# EAGLE design FAB_FTDI (EAGLE 7.3.0)
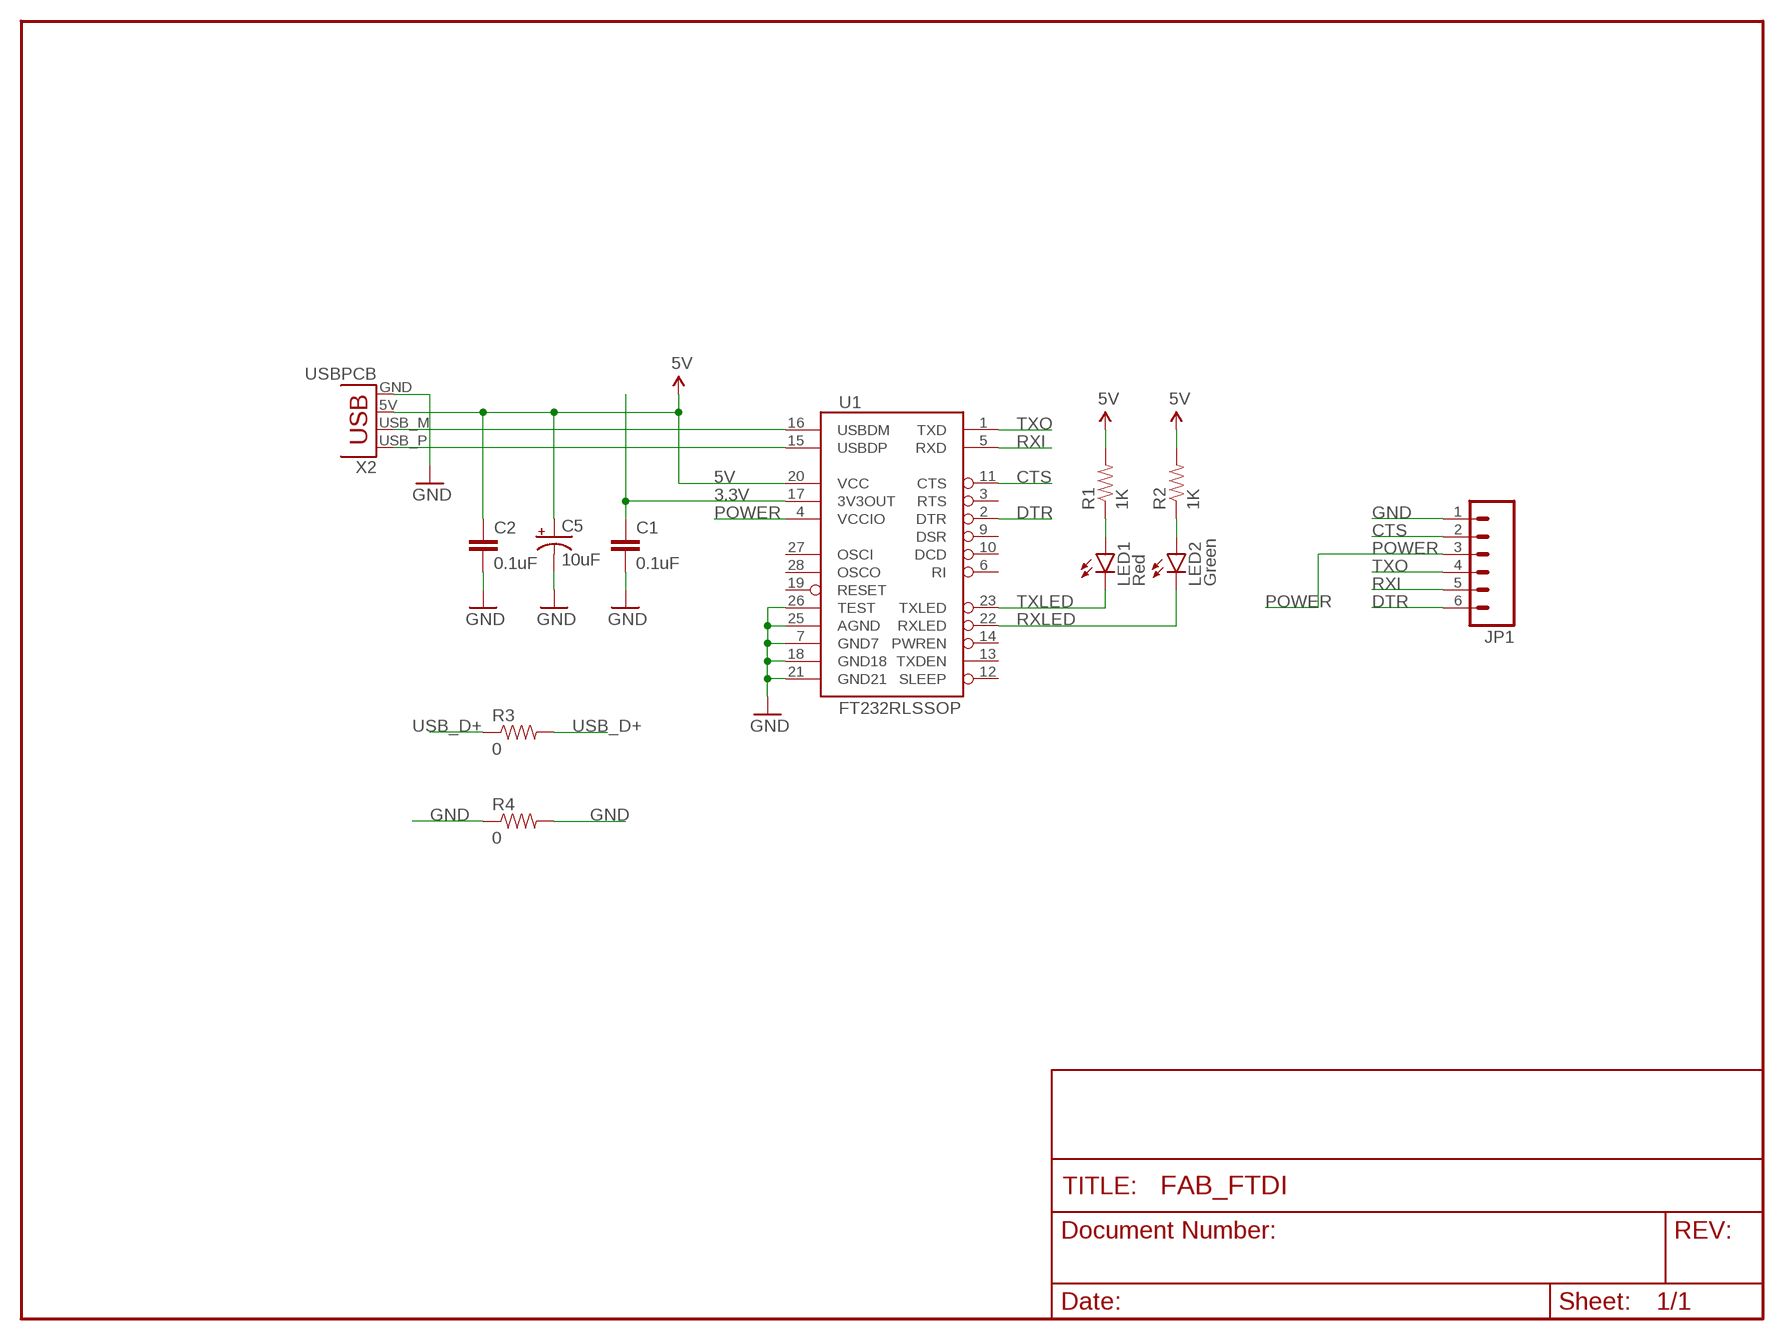
[diagram p0: schematic, sheet 1]

## Parts
C1  0.1uF  CAP1206  [1206]
C2  0.1uF  CAP1206  [1206]
C5  10uF  CAP_POL1206  [EIA3216]
JP1  M06SMD-FEMALE-V2  [1X06-SMD-FEMALE-V2]
LED1  Red  LED1206  [LED-1206]
LED2  Green  LED1206  [LED-1206]
R1  1K  RESISTOR1206  [1206]
R2  1K  RESISTOR1206  [1206]
R3  0  RESISTOR1206  [1206]
R4  0  RESISTOR1206  [1206]
U1  FT232RLSSOP  [SSOP28DB]
X2  USBPCB  [USB-A-PCB]

## Nets
3.3V [power]: C1.1 U1.17(3V3OUT)
5V: C2.1 C5.A(+) R1.2 R2.2 U1.20(VCC) X2.5V(VBUS)
CTS: JP1.2 U1.11(CTS)
DTR: JP1.6 U1.2(DTR)
GND [power]: C1.2 C2.2 C5.C(-) JP1.1 R4.1 R4.2 U1.7(GND7) U1.18(GND18) U1.21(GND21) U1.25(AGND) U1.26(TEST) X2.GND
N$1: LED1.A R1.1
N$2: LED2.A R2.1
POWER: JP1.3 U1.4(VCCIO)
RXI: JP1.5 U1.5(RXD)
RXLED: LED2.C U1.22(RXLED)
TXLED: LED1.C U1.23(TXLED)
TXO: JP1.4 U1.1(TXD)
USB_D+: R3.1 R3.2 U1.15(USBDP) X2.USB_P(D+)
USB_D-: U1.16(USBDM) X2.USB_M(D-)
Unconnected: U1.3(RTS) U1.6(RI) U1.9(DSR) U1.10(DCD) U1.12(SLEEP) U1.13(TXDEN) U1.14(PWREN) U1.19(RESET) U1.27(OSCI) U1.28(OSCO)

## Library data of the parts
C1 C2 = SparkFun-Capacitors:CAP: Capacitor Standard 0603 ceramic capacitor, and 0.1" leaded capacitor.
C5 = SparkFun:CAP_POL: Capacitor Polarized These are standard SMD and PTH capacitors. Normally 10uF, 47uF, and 100uF in electrolytic and tantalum varieties. Always verify the external diameter of the through hole cap, it varies with capacity, voltage, and manufacturer. The EIA devices should be standard.
JP1 = SparkFun:M06: Header 6 Standard 6-pin 0.1" header. Use with straight break away headers (SKU : PRT-00116), right angle break away headers (PRT-00553), swiss pins (PRT-00743), machine pins (PRT-00117), and female headers (PRT-00115). Molex polarized connector foot print use with SKU : PRT-08094 with associated crimp pins and housings. NOTES ON THE VARIANTS LOCK and LOCK_LONGPADS... This footprint was designed to help hold the alignment of a through-hole component (i.e. 6-pin header) while soldering it into place. You may notice that each hole has been shifted either up or down by 0.005 of an inch from it's more standard position (which is a perfectly straight line). This slight alteration caused the pins (the squares in the middle) to touch the edges of the holes. Because they are alternating, it causes a "brace" to hold the component in place. 0.005 has proven to be the perfect amount of "off-center" position when using our standard breakaway headers. Although looks a little odd when you look at the bare footprint, once you have a header in there, the alteration is very hard to notice. Also, if you push a header all the way into place, it is covered up entirely on the bottom side. This idea of altering the position of holes to aid alignment will be further integrated into the Sparkfun Library for other footprints. It can help hold any component with 3 or more connection pins.
LED1 LED2 = SparkFun-LED:LED: LEDs Standard schematic elements and footprints for 5mm, 3mm, 1206, and 0603 sized LEDs. 5mm - Spark Fun Electronics SKU : COM-00529 (and others)
R1-R4 = SparkFun-Resistors:RESISTOR: Resistor Basic schematic elements and footprints for 0603, 1206, and PTH resistors.
U1 = SparkFun:FT232RL: USB UART FT232RL 4th Generation USB UART (USB <-> Serial) Controller. Spark Fun Electronics SKU : COM-00650
X2 = SparkFun-Connectors:USB: USB Connectors USB-B-PTH is fully proven SKU : PRT-00139/CONN-08278 USB-miniB is fully proven SKU : PRT-00587 USB-A-PCB is untested. USB-A-H is throughly reviewed, but untested. Spark Fun Electronics SKU : PRT-00437 USB-B-SMT is throughly reviewed, but untested. Needs silkscreen touching up. USB-A-S has not been used/tested USB-MB-H has not been used/tested USB-MICROB has been used. CONN-09505

## Net classes
0 default: width 0.203 mm
1 power: width 0.254 mm

## Board
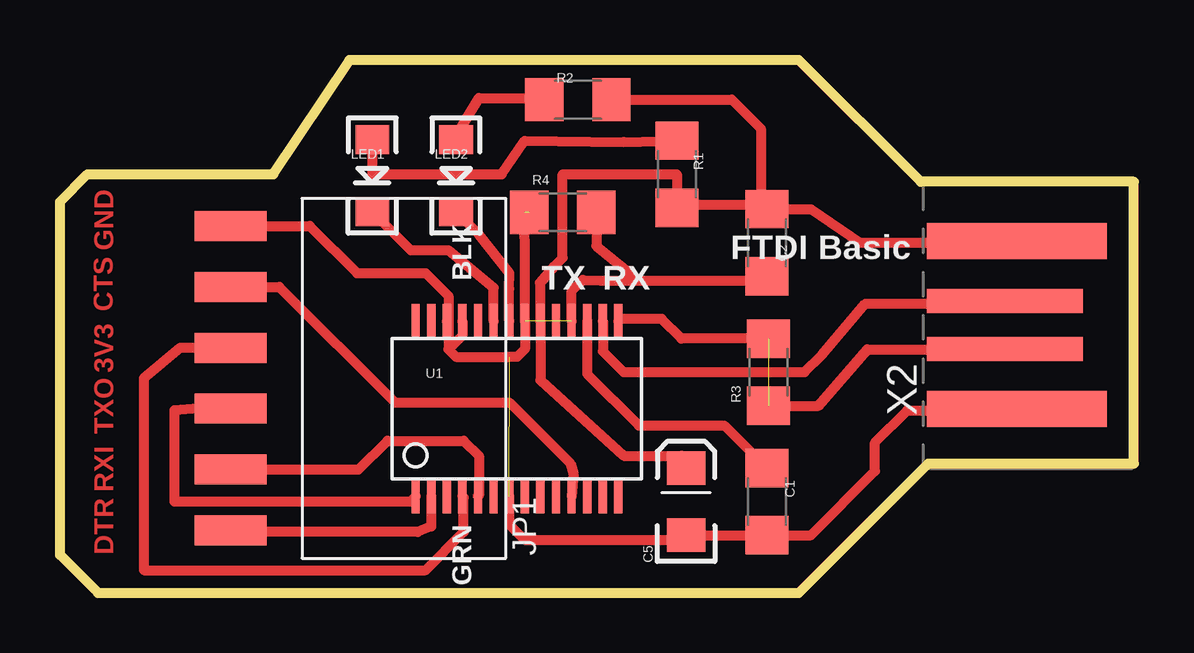
[diagram p1: board, top side]

Size 44.77 x 22.23 mm. Coordinates in mm from the lower left corner, seen from the top.
Outline: 1.59,0 30.8,0 36.2,5.4 44.77,5.4 44.77,17.14 35.88,17.14 30.8,22.23 12.06,22.23 8.89,17.46 1.15,17.46 0,16.32 0,1.59 1.59,0
Copper layers (1*16): Top 0.035mm / dielectric 1.5mm / Bottom 0.035mm
Design rules "SparkFun": minimum track width 8mil, minimum drill 20mil, track to track 8mil, track to pad 8mil, pad to pad 8mil, via to via 8mil, smd to smd 8mil, copper to edge 8mil, drill to drill 8mil, minimum pad ring 12mil, minimum via ring 10mil, stop-mask expansion 4mil, vias tented up to drill 20mil, thermal gap 10mil

### Footprints (pad centres in the part's own frame; a part is rotated, then mirrored left to right if it is on the bottom)
1206 = smd 1.6 x 1.8: 1 -1.4,0; 2 1.4,0
EIA3216 = smd 1.4 x 1.6: A 1.4,0; C -1.4,0
1X06-SMD-FEMALE-V2 = smd 1.25 x 3: 1 6.35,3.425; 2 3.81,3.425; 3 1.27,3.425; 4 -1.27,3.425; 5 -3.81,3.425; 6 -6.35,3.425
LED-1206 = smd 1.2 x 1.4: A -1.5,0; C 1.5,0
SSOP28DB = smd 0.348 x 1.397: 1 -4.225,-3.656; 2 -3.575,-3.656; 3 -2.925,-3.656; 4 -2.275,-3.656; 5 -1.625,-3.656; 6 -0.975,-3.656; 7 -0.325,-3.656; 8 0.325,-3.656; 9 0.975,-3.656; 10 1.625,-3.656; 11 2.275,-3.656; 12 2.925,-3.656; 13 3.575,-3.656; 14 4.225,-3.656; 15 4.225,3.656; 16 3.575,3.656; 17 2.925,3.656; 18 2.275,3.656; 19 1.625,3.656; 20 0.975,3.656; 21 0.325,3.656; 22 -0.325,3.656; 23 -0.975,3.656; 24 -1.625,3.656; 25 -2.275,3.656; 26 -2.925,3.656; 27 -3.575,3.656; 28 -4.225,3.656
USB-A-PCB = smd 7.5 x 1.5: 5V -0.2,-3.5; GND -0.2,3.5 | smd 6.5 x 1: USB_M 0.3,-1; USB_P 0.3,1

### Placement (x,y rotation side)
C1  29.46,3.81 270 top
C2  29.46,14.61 270 top
C5  26.1,3.81 90 top
JP1  10.54,8.95 90 top
LED1  13.02,17.4 270 top
LED2  16.51,17.4 270 top
R1  25.72,17.46 270 top
R2  21.59,20.57 0 top
R3  29.53,9.21 90 top
R4  20.95,15.88 0 top
U1  19.05,7.68 0 top
X2  39.69,11.18 180 top

### Tracks (layer width: path | path; a pad name or v marks a point on that pad's centre or on a via)
3.3V
  Top 0.406: U1.17 21.97,9.14 24.13,6.99 27.69,6.99 C1.1
5V
  Top 0.406: X2.5V 39.5,14.61 33.34,14.61 31.3,16 C2.1 29.28,16.19 | C5.A 25.91,5.71 23.49,5.71 20.02,8.87 U1.20 20.02,12.93 20,12.93 20.64,13.65 20.95,13.97 20.95,17.46 25.72,17.46 25.72,16.19 | R1.2 25.72,16.19 | 25.72,16.19 29.28,16.19 | R2.2 28,20.57 29.21,19.37 29.21,16.26 29.28,16.19
CTS
  Top 0.406: JP1.2 9.14,12.76 13.97,7.94 18.73,7.94 21.27,5.4 21.4,4.97 U1.11
DTR
  Top 0.406: U1.2 15.47,2.77 14.92,2.54 7.5,2.54 JP1.6
GND  (3 unrouted)
  Top 0.406: U1.7 18.72,2.86 19.37,2.22 25.91,2.22 C5.C C1.2 31.3,2.41 33.97,5.08 33.97,6.27 35.32,7.62 39.51,7.62 X2.GND | U1.18 21.32,12.6 21.8,13.05 22.54,13.02 24.13,13.02 | 24.13,13.02 29.28,13.02 C2.2 | JP1.1 10.41,15.3 12.38,13.34 15.24,13.34 16.19,12.38 16.19,11.41 | 16.19,11.41 U1.26 | 16.19,11.41 16.19,10.16 | 16.19,10.16 16.51,9.84 18.73,9.84 19.05,9.85 19.38,10.17 U1.21 19.38,13.64 19.37,15.88 | U1.25 16.77,10.74 16.19,10.16 | R4.2 22.35,14.47 24.13,13.02
N$1
  Top 0.406: LED1.A 13.02,17.46 18.41,17.46 19.37,18.86 23.49,18.8 R1.1
N$2
  Top 0.406: LED2.A 16.51,19.05 17.46,20.64 19.81,20.64 R2.1
POWER
  Top 0.406: JP1.3 5.02,10.22 3.49,8.95 3.49,0.95 15.24,0.95 16.83,2.54 16.83,3.98 U1.4
RXI
  Top 0.406: JP1.5 12.45,5.14 13.65,6.35 16.83,6.35 17.46,5.71 17.46,4.06 U1.5
RXLED
  Top 0.406: U1.22 18.72,12.69 18.73,13.34 17.46,14.95 LED2.C
TXLED
  Top 0.406: U1.23 18.07,12.72 16.19,14.29 14.63,14.29 LED1.C
TXO
  Top 0.406: JP1.4 5.78,7.68 4.76,7.62 4.76,3.81 14.61,3.81 U1.1
USB_D+  (1 unrouted)
  Top 0.406: R3.2 25.9,10.61 25.08,11.43 23.36,11.43 U1.15 | R3.1 31.62,7.81 33.66,10.16 39.05,10.16 X2.USB_P
USB_D-
  Top 0.406: U1.16 22.62,10.08 23.49,9.21 31.04,9.21 31.75,9.92 33.58,12.07 39.59,12.07 X2.USB_M

### Text on the board
Top: GND | CTS | 3V3 | TXO | RXI | DTR
tPlace: FTDI Basic | BLK | TX | RX | GRN